# Altium schematic sheet 02_INTERFACE.SchDoc
size D; SheetNumber: 0; SheetTotal: 0
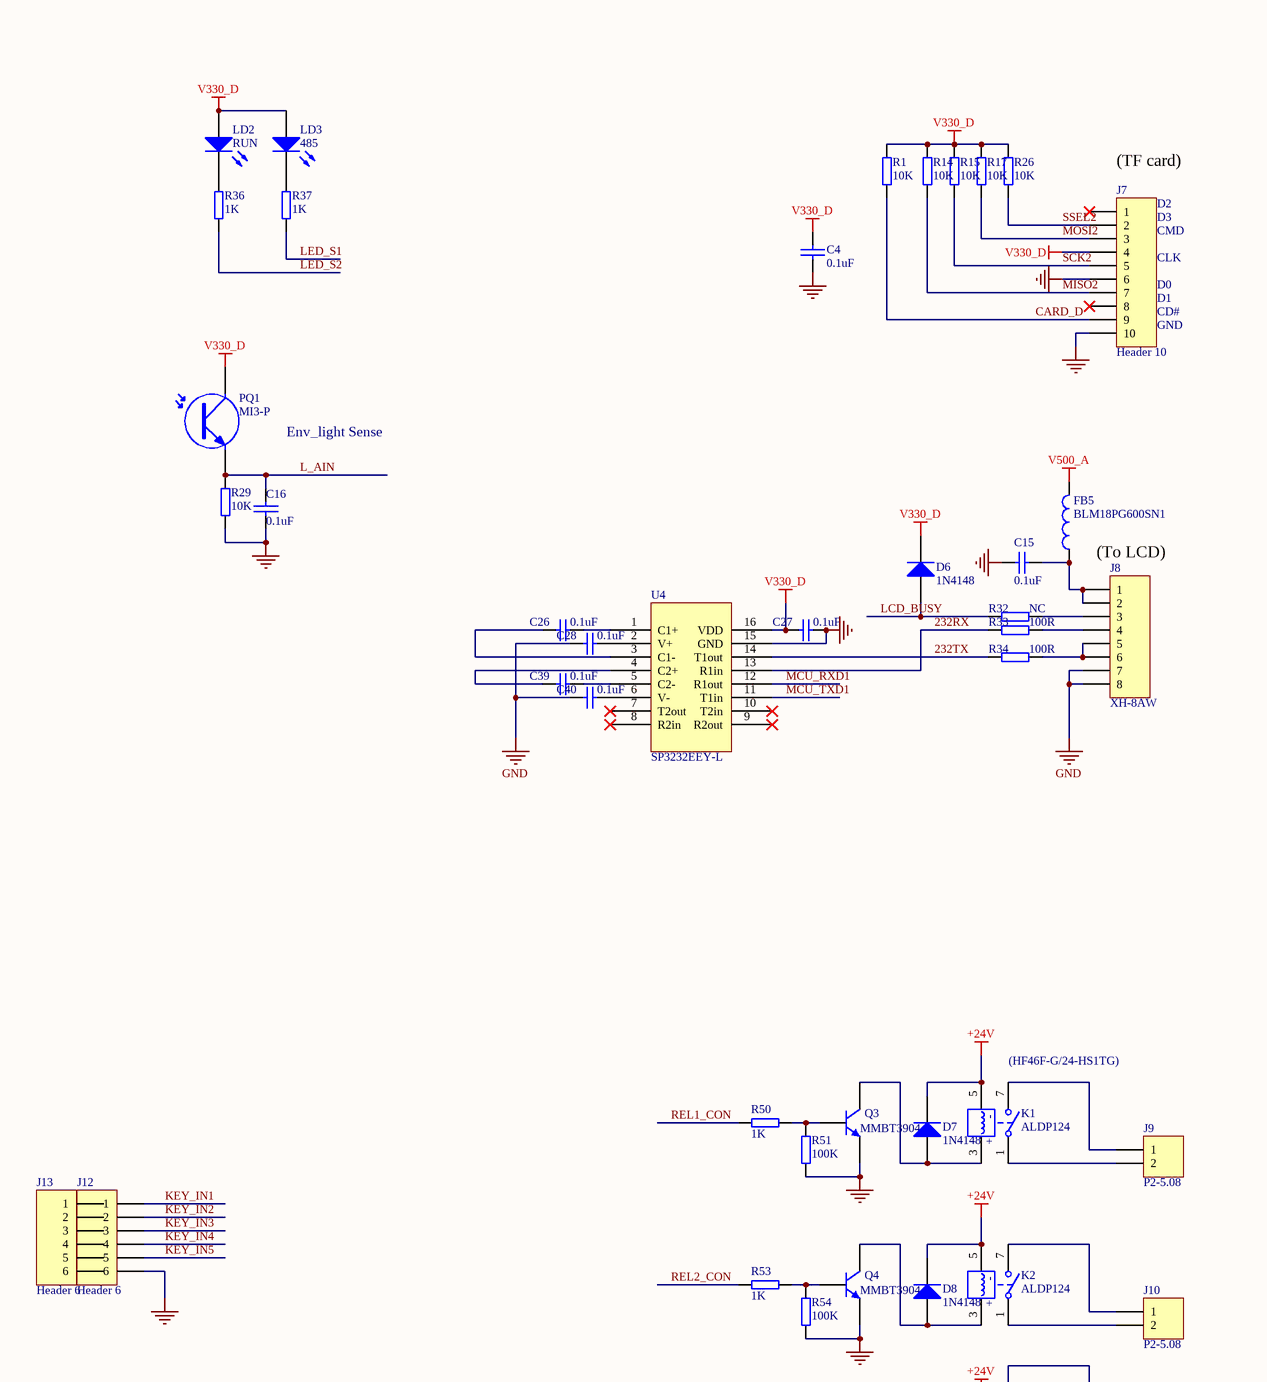
[diagram p0: 02_INTERFACE.SchDoc, top left]
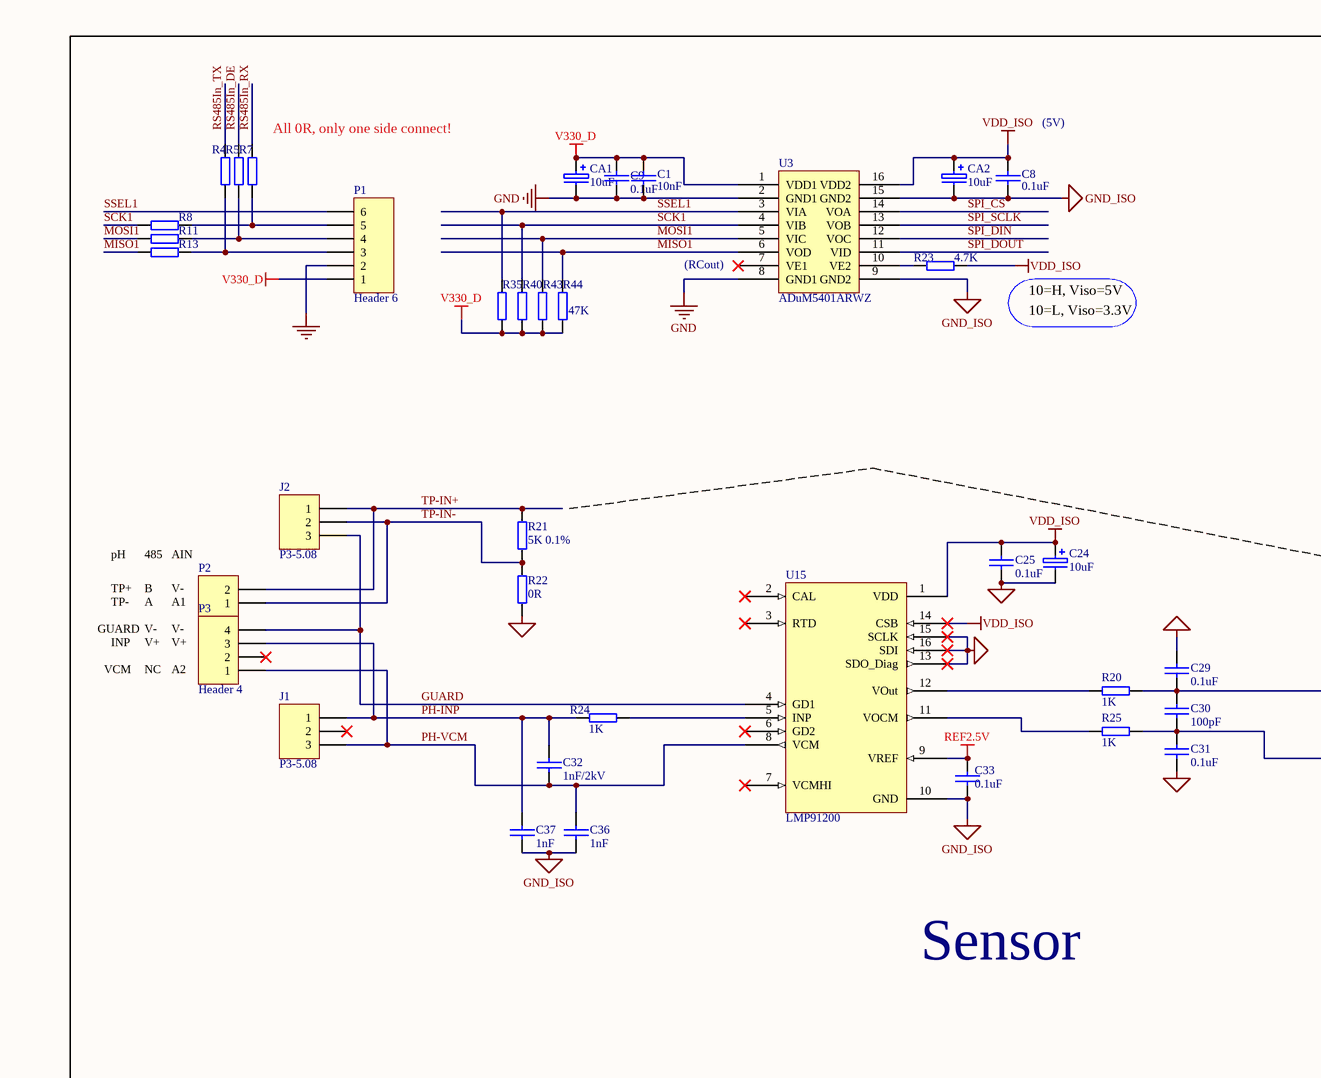
[diagram p1: 02_INTERFACE.SchDoc, top middle]
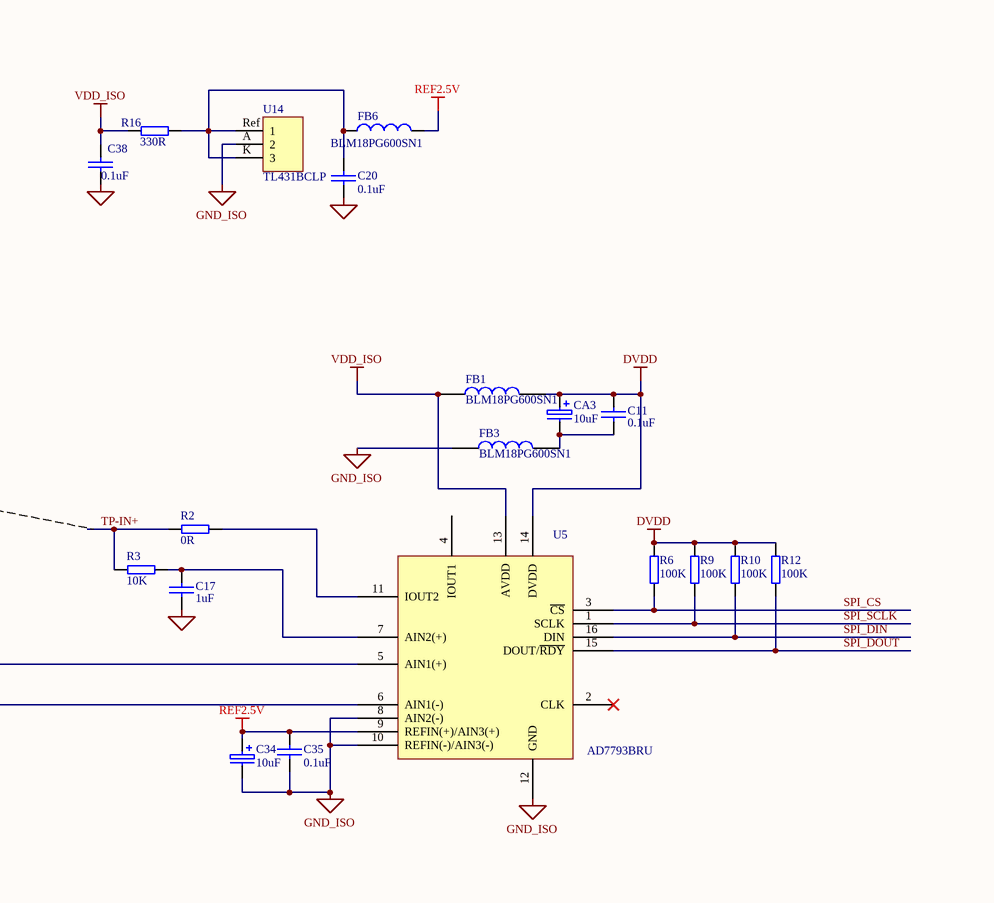
[diagram p2: 02_INTERFACE.SchDoc, top right]
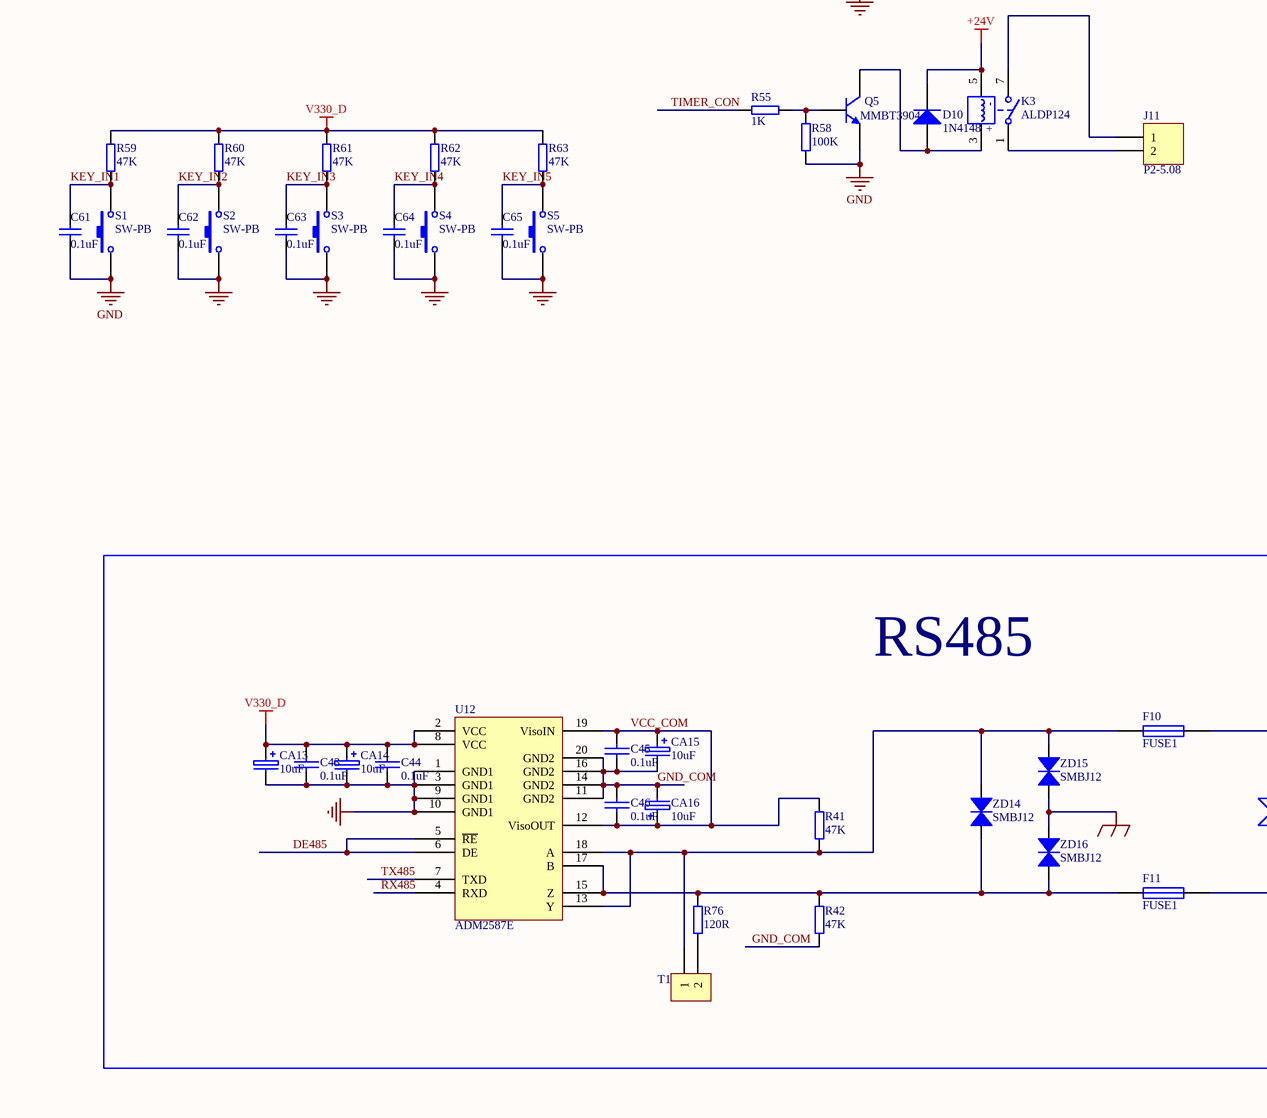
[diagram p3: 02_INTERFACE.SchDoc, bottom left]
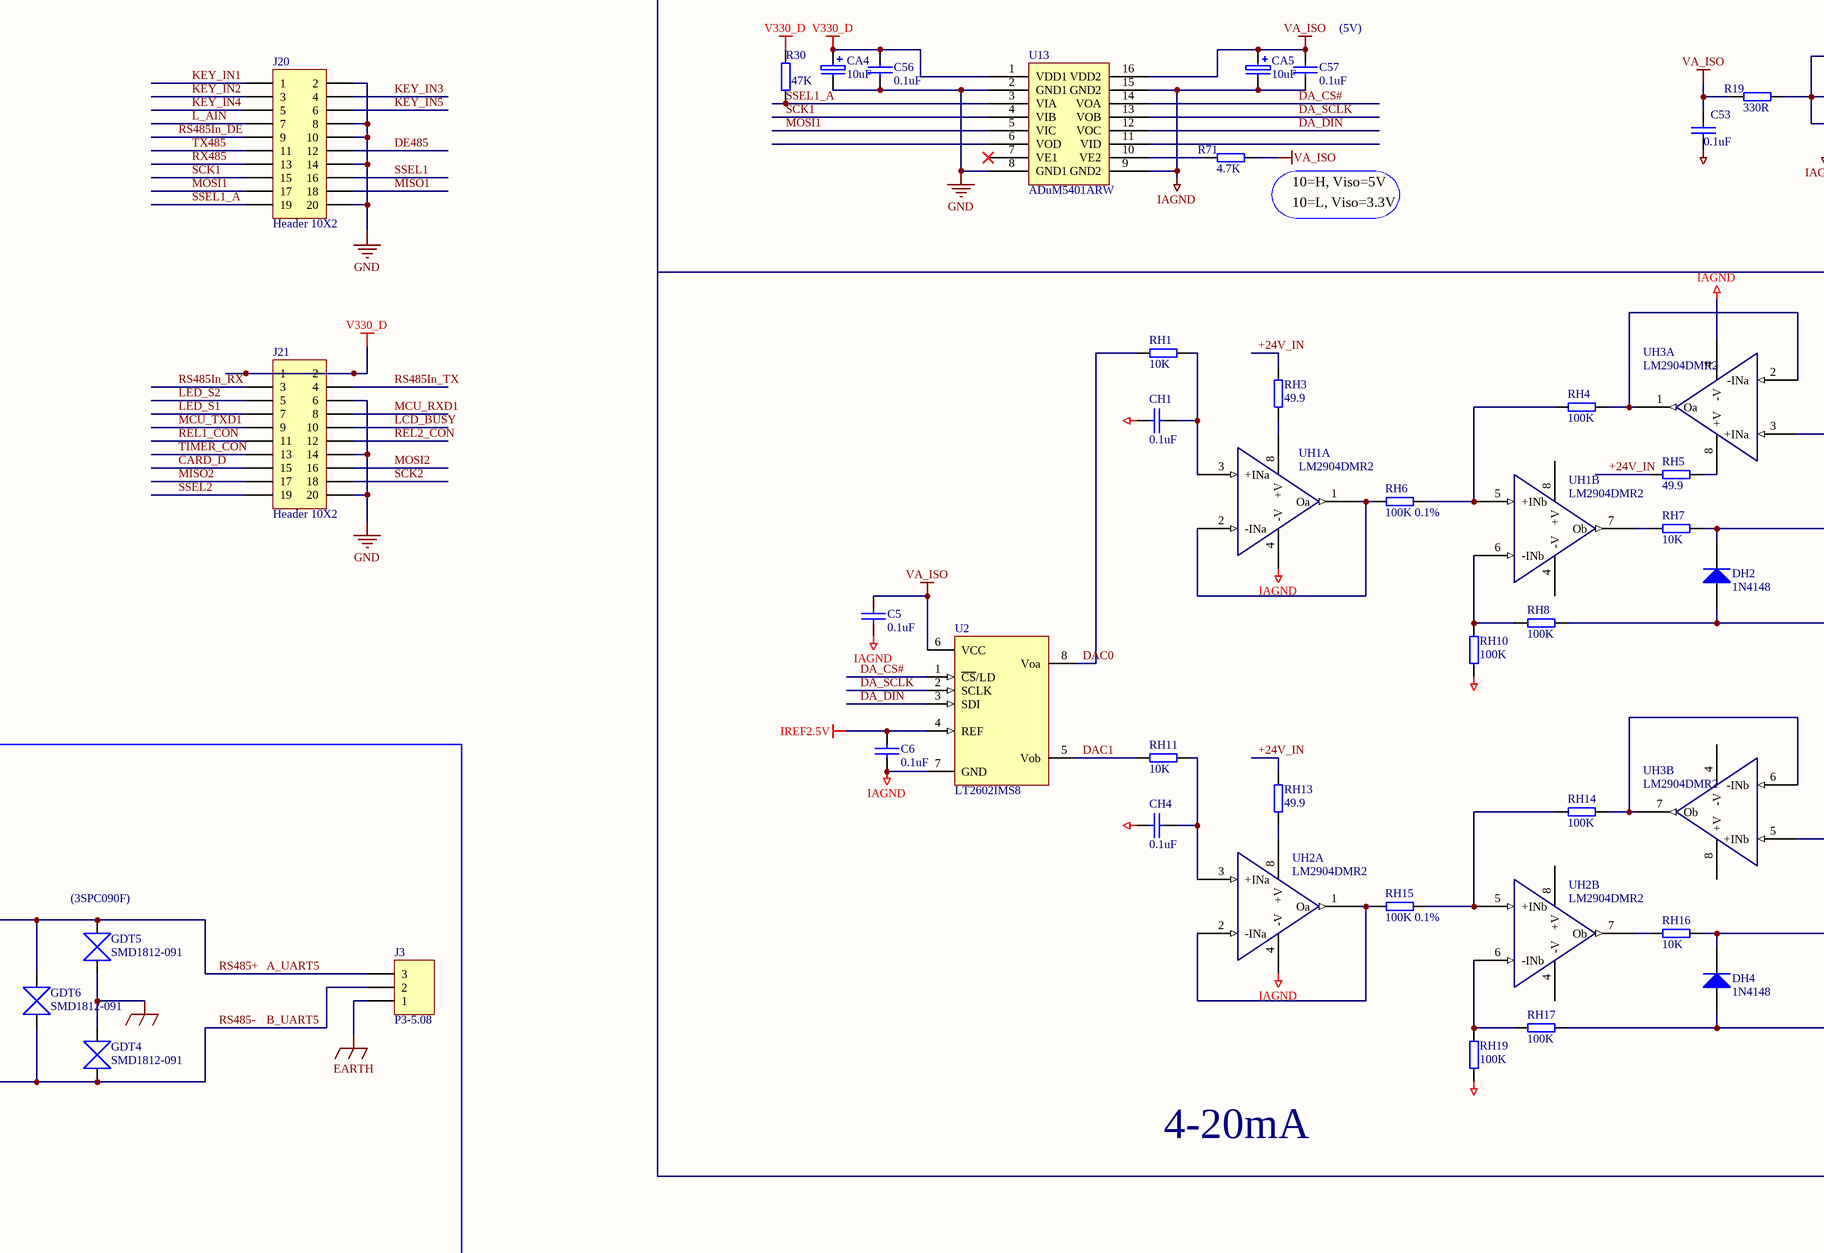
[diagram p4: 02_INTERFACE.SchDoc, bottom middle]
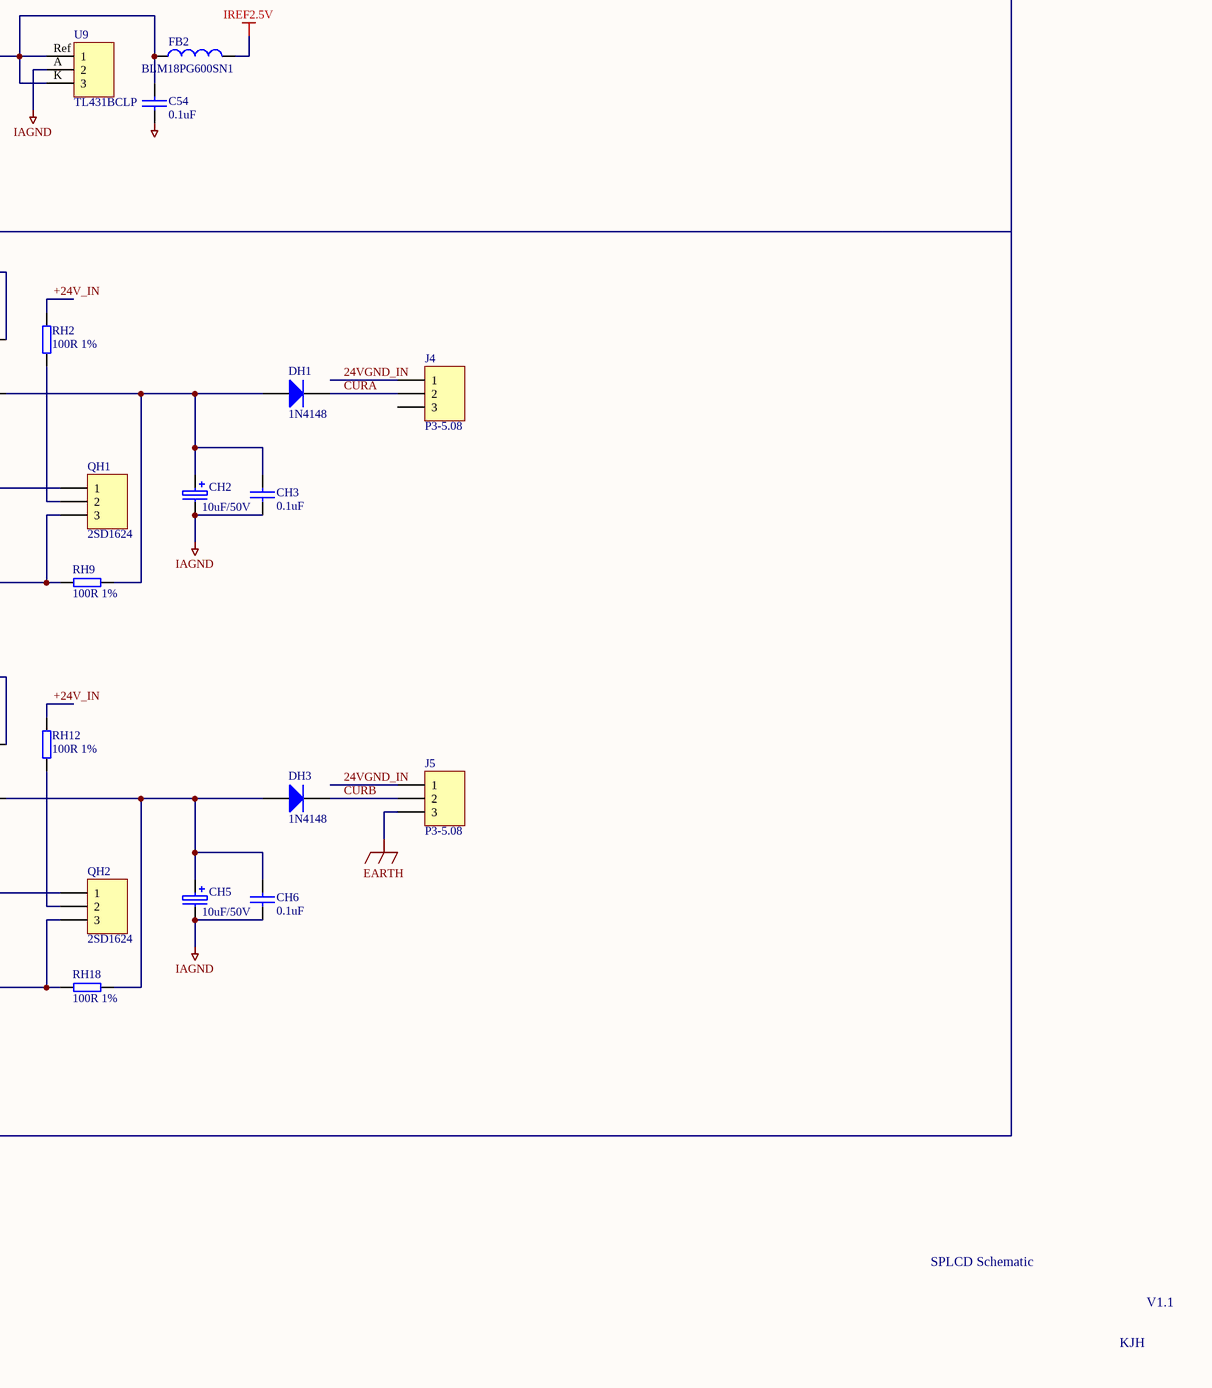
[diagram p5: 02_INTERFACE.SchDoc, bottom right]

## Parts
C1  10nF  [0603A]
C4  0.1uF  [0603A]
C5  0.1uF  [0603A]
C6  0.1uF  [0603A]
C8  0.1uF  [0603A]
C9  0.1uF  [0603A]
C11  0.1uF  [0603A]
C15  0.1uF  [0603A]
C16  0.1uF  [0603]
C17  1uF  [0603A]
C20  0.1uF  [0603A]
C24  10uF  [1206]
C25  0.1uF  [0603A]
C26  0.1uF  [0603A]
C27  0.1uF  [0603A]
C28  0.1uF  [0603A]
C29  0.1uF  [0603A]
C30  100pF  [0603A]
C31  0.1uF  [0603A]
C32  1nF/2kV  [RAD-0.2]
C33  0.1uF  [0603A]
C34  10uF  [1206]
C35  0.1uF  [0603A]
C36  1nF  [0603A]
C37  1nF  [0603A]
C38  0.1uF  [0603A]
C39  0.1uF  [0603A]
C40  0.1uF  [0603A]
C43  0.1uF  [0603]
C44  0.1uF  [0603]
C45  0.1uF  [0603]
C46  0.1uF  [0603]
C53  0.1uF  [0603A]
C54  0.1uF  [0603A]
C56  0.1uF  [0603A]
C57  0.1uF  [0603A]
C61  0.1uF  [0603A]
C62  0.1uF  [0603A]
C63  0.1uF  [0603A]
C64  0.1uF  [0603A]
C65  0.1uF  [0603A]
CA1  10uF  [1206]
CA2  10uF  [1206]
CA3  10uF  [1206]
CA4  10uF  [1206]
CA5  10uF  [1206C]
CA13  10uF  [1206C]
CA14  10uF  [1206C]
CA15  10uF  [1206C]
CA16  10uF  [1206C]
CH1  0.1uF  [0603A]
CH2  10uF/50V  [1206]
CH3  0.1uF  [0603A]
CH4  0.1uF  [0603A]
CH5  10uF/50V  [1206]
CH6  0.1uF  [0603A]
D6  1N4148  [1206]
D7  1N4148  [1206]
D8  1N4148  [1206]
D10  1N4148  [1206]
DH1  1N4148  [1206D]
DH2  1N4148  [1206D]
DH3  1N4148  [1206D]
DH4  1N4148  [1206D]
F10  FUSE1  [1206]
F11  FUSE1  [1206]
FB1  BLM18PG600SN1  [0603A]
FB2  BLM18PG600SN1  [0603A]
FB3  BLM18PG600SN1  [0603A]
FB5  BLM18PG600SN1  [0603A]
FB6  BLM18PG600SN1  [0603A]
GDT4  SMD1812-091  [1812]
GDT5  SMD1812-091  [1812]
GDT6  SMD1812-091  [1812]
J1  P3-5.08  [PH3-5.08mm]
J2  P3-5.08  [PH3-5.08mm]
J3  P3-5.08  [PH3-5.08mm]
J4  P3-5.08  [PH3-5.08mm]
J5  P3-5.08  [PH3-5.08mm]
J7  Header 10  [TF Socket]
J8  XH-8AW  [HDR1X8]
J9  P2-5.08  [PH2-5.08mm]
J10  P2-5.08  [PH2-5.08mm]
J11  P2-5.08  [PH2-5.08mm]
J12  Header 6  [HDR1X6]
J13  Header 6  [HDR1X6]
J20  Header 10X2  [HDR2X10]
J21  Header 10X2  [HDR2X10]
K1  ALDP124  [ALDP124]
K2  ALDP124  [ALDP124]
K3  ALDP124  [ALDP124]
LD2  RUN  [LED]
LD3  485  [LED]
P1  Header 6  [HDR1X6]
P2  Header 2  [HDR1X2]  (value not drawn)
P3  Header 4  [HDR1X4]
PQ1  MI3-P  [LED]
Q3  MMBT3904  [SOT23_N]
Q4  MMBT3904  [SOT23_N]
Q5  MMBT3904  [SOT23_N]
QH1  2SD1624  [SOT89M]
QH2  2SD1624  [SOT89M]
R1  10K  [0603A]
R2  0R  [0603A]
R3  10K  [0603A]
R4  0R  [0603A]  (value not drawn)
R5  0R  [0603A]  (value not drawn)
R6  100K  [0603A]
R7  0R  [0603A]  (value not drawn)
R8  0R  [0603A]  (value not drawn)
R9  100K  [0603A]
R10  100K  [0603A]
R11  0R  [0603A]  (value not drawn)
R12  100K  [0603A]
R13  0R  [0603A]  (value not drawn)
R14  10K  [0603A]
R15  10K  [0603A]
R16  330R  [0603A]
R17  10K  [0603A]
R19  330R  [0603A]
R20  1K  [0603A]
R21  5K 0.1%  [0603A]
R22  0R  [0603A]
R23  4.7K  [0603A]
R24  1K  [0603A]
R25  1K  [0603A]
R26  10K  [0603A]
R29  10K  [0603A]
R30  47K  [0603A]
R32  NC  [0603A]
R33  100R  [0603A]
R34  100R  [0603A]
R35  47K  [0603A]  (value not drawn)
R36  1K  [0603A]
R37  1K  [0603A]
R40  47K  [0603A]  (value not drawn)
R41  47K  [0603]
R42  47K  [0603]
R43  47K  [0603A]  (value not drawn)
R44  47K  [0603A]
R50  1K  [0603A]
R51  100K  [0603A]
R53  1K  [0603A]
R54  100K  [0603A]
R55  1K  [0603A]
R58  100K  [0603A]
R59  47K  [0603A]
R60  47K  [0603A]
R61  47K  [0603A]
R62  47K  [0603A]
R63  47K  [0603A]
R71  4.7K  [0603A]
R76  120R  [0603]
RH1  10K  [0603A]
RH2  100R 1%  [0603A]
RH3  49.9  [0603A]
RH4  100K  [0603A]
RH5  49.9  [0603A]
RH6  100K 0.1%  [0603A]
RH7  10K  [0603A]
RH8  100K  [0603A]
RH9  100R 1%  [0603A]
RH10  100K  [0603A]
RH11  10K  [0603A]
RH12  100R 1%  [0603A]
RH13  49.9  [0603A]
RH14  100K  [0603A]
RH15  100K 0.1%  [0603A]
RH16  10K  [0603A]
RH17  100K  [0603A]
RH18  100R 1%  [0603A]
RH19  100K  [0603A]
S1  SW-PB
S2  SW-PB
S3  SW-PB
S4  SW-PB
S5  SW-PB
T1  (no value)  [SIP2]
U2  LT2602IMS8  [LT2602]
U3  ADuM5401ARWZ  [ADUM1401]
U4  SP3232EEY-L  [TSSOP-16]
U5  AD7793BRU  [AD7793]
U9  TL431BCLP  [HDR1X3]
U12  ADM2587E  [SOL-20]
U13  ADuM5401ARW  [ADUM1401]
U14  TL431BCLP  [HDR1X3]
U15  LMP91200  [LMP91200]
UH1  LM2904DMR2  [SO8_M]  (parts A,B of 2)
UH2  LM2904DMR2  [SO8_M]  (parts A,B of 2)
UH3  LM2904DMR2  [SO8_M]  (parts A,B of 2)
ZD14  SMBJ12  [ZD]
ZD15  SMBJ12  [ZD]
ZD16  SMBJ12  [ZD]

## Blocks framed on the sheet
Sensor: C1 C8 C9 C11 C17 C20 C24 C25 C29-C38 CA1-CA3 FB1 FB3 FB6 J1 J2 P1-P3 R2-R13 R16 R20-R25 R35 R40 R43 R44 U3 U5 U14 U15
RS485: C43-C46 CA13-CA16 F10 F11 GDT4-GDT6 J3 R41 R42 R76 T1 U12 ZD14-ZD16

## Nets
+24V: D7.2(K) D8.2(K) D10.2(K) K1.5 K2.5 K3.5
DVDD: C11.1 CA3.1 FB1.2 R6.1 R9.1 R10.1 R12.1 U5.14(DVDD)
EARTH: GDT4.2 GDT5.1 J3.1 J5.3 ZD15.2 ZD16.1
GND: C1.2 C4.1 C9.1 C15.2 C16.2 C27.1 C28.2 C40.2 C43.2 C44.2 C56.2 C61.2 C62.2 C63.2 C64.2 C65.2 CA1.2 CA4.2 CA13.2 CA14.2 J7.6 J7.10 J8.7 J8.8 J12.6 J20.2 J20.8 J20.10 J20.14 J20.20 J21.6 J21.14 J21.20 P1.2 Q3.2(E) Q4.2(E) Q5.2(E) R29.1 R51.2 R54.2 R58.2 S1.1 S2.1 S3.1 S4.1 S5.1 U3.2(GND1) U3.8(GND1) U4.15(GND) U12.1(GND1) U12.3(GND1) U12.9(GND1) U12.10(GND1) U13.2(GND1) U13.8(GND1)
GND_ISO: C8.2 C17.2 C20.2 C24.2 C25.2 C29.1 C31.2 C33.2 C34.2 C35.2 C36.2 C37.2 C38.2 CA2.2 FB3.1 R22.2 U3.9(GND2) U3.15(GND2) U5.8(AIN2(-)) U5.10(REFIN(-)/AIN3(-)) U5.12(GND) U14.2 U15.10(GND) U15.13(SDO_Diag) U15.15(SCLK) U15.16(SDI)
IAGND: C5.2 C6.2 C53.2 C54.2 C57.2 CA5.2 CH1.1 CH2.2 CH3.1 CH4.1 CH5.2 CH6.1 RH10.2 RH19.2 U2.7(GND) U9.2 U13.9(GND2) U13.15(GND2) UH1.4(-V) UH2.4(-V) UH3.4(-V)
IREF2.5V: C6.1 FB2.2 U2.4(REF)
REF2.5V: C33.1 C34.1 C35.1 FB6.2 U5.9(REFIN(+)/AIN3(+)) U15.9(VREF)
V330_D: C1.1 C4.2 C9.2 C27.2 C43.1 C44.1 C56.1 CA1.1 CA4.1 CA13.1 CA14.1 D6.2(K) J7.4 J21.1 J21.2 LD2.1(A) LD3.1(A) P1.1 PQ1.1(C) R1.2 R14.2 R15.2 R17.2 R26.2 R30.2 R35.1 R40.1 R43.1 R44.1 R59.2 R60.2 R61.2 R62.2 R63.2 U3.1(VDD1) U4.16(VDD) U12.2(VCC) U12.8(VCC) U13.1(VDD1)
V500_A: FB5.2
VA_ISO: C5.1 C53.1 C57.1 CA5.1 R19.2 R71.1 U2.6(VCC) U13.16(VDD2)
VDD_ISO: C8.1 C24.1 C25.1 C38.1 CA2.1 FB1.1 R16.2 R23.2 U3.16(VDD2) U5.13(AVDD) U15.1(VDD) U15.14(CSB)
24VGND_IN: J4.1 J5.1
232RX: R33.2 U4.13(R1in)
232TX: R34.2 U4.14(T1out)
+24V_IN: RH2.1 RH3.1 RH5.1 RH12.1 RH13.1
A_UART5: F10.2 GDT5.2 GDT6.2 J3.3  [also labelled RS485+]
B_UART5: F11.2 GDT4.1 GDT6.1 J3.2  [also labelled RS485-]
CARD_D: J7.9 J21.15 R1.1
CURA: DH1.2(K) J4.2
CURB: DH3.2(K) J5.2
DA_CS#: U2.1(~{CS}/LD) U13.14(VOA)
DA_DIN: U2.3(SDI) U13.12(VOC)
DA_SCLK: U2.2(SCLK) U13.13(VOB)
DAC0: RH1.2 U2.8(Voa)
DAC1: RH11.2 U2.5(Vob)
DE485: J20.12 U12.5(~{RE}) U12.6(DE)
GND_COM: C45.2 C46.1 CA15.2 CA16.2 R42.2 U12.11(GND2) U12.14(GND2) U12.16(GND2) U12.20(GND2)
GUARD: J2.3 P3.4 U15.4(GD1)
KEY_IN1: C61.1 J12.1 J20.1 R59.1 S1.2
KEY_IN2: C62.1 J12.2 J20.3 R60.1 S2.2
KEY_IN3: C63.1 J12.3 J20.4 R61.1 S3.2
KEY_IN4: C64.1 J12.4 J20.5 R62.1 S4.2
KEY_IN5: C65.1 J12.5 J20.6 R63.1 S5.2
L_AIN: C16.1 J20.7 PQ1.3(E) R29.2
LCD_BUSY: D6.1(A) J21.10 R32.2
LED_S1: J21.7 R37.1
LED_S2: J21.5 R36.1
MCU_RXD1: J21.8 U4.12(R1out)
MCU_TXD1: J21.9 U4.11(T1in)
MISO1: J20.18 R13.2 R44.2 U3.6(VOD)
MISO2: J7.7 J21.17 R14.1
MOSI1: J20.17 R11.2 R43.2 U3.5(VIC) U13.5(VIC)
MOSI2: J7.3 J21.16 R17.1
PH-INP: C32.1 C37.1 J1.1 P3.3 R24.1
PH-VCM: C32.2 C36.1 J1.3 P3.1 U15.8(VCM)
REL1_CON: J21.11 R50.2
REL2_CON: J21.12 R53.2
RS485In_DE: J20.9 R5.1
RS485In_RX: J21.3 R7.1
RS485In_TX: J21.4 R4.1
RX485: J20.13 U12.4(RXD)
SCK1: J20.15 R8.2 R40.2 U3.4(VIB) U13.4(VIB)
SCK2: J7.5 J21.18 R15.1
SPI_CS: R6.2 U3.14(VOA) U5.3(~{CS})
SPI_DIN: R10.2 U3.12(VOC) U5.16(DIN)
SPI_DOUT: R12.2 U3.11(VID) U5.15(DOUT/~{RDY})
SPI_SCLK: R9.2 U3.13(VOB) U5.1(SCLK)
SSEL1: J20.16 P1.6 R35.2 U3.3(VIA)
SSEL1_A: J20.19 R30.1 U13.3(VIA)
SSEL2: J7.2 J21.19 R26.1
TIMER_CON: J21.13 R55.2
TP-IN+: J2.1 P2.2 R2.1 R3.1 R21.2
TP-IN-: J2.2 P2.1 R21.1 R22.1
TX485: J20.11 U12.7(TXD)
VCC_COM: C45.1 C46.2 CA15.1 CA16.1 R41.1 U12.12(VisoOUT) U12.19(VisoIN)
NetC11_2: C11.2 CA3.2 FB3.2
NetC15_1: C15.1 FB5.1 J8.1 J8.2
NetC17_1: C17.1 R3.2 U5.7(AIN2(+))
NetC20_1: C20.1 FB6.1 R16.1 U14.1 U14.3
NetC26_1: C26.1 U4.1(C1+)
NetC26_2: C26.2 U4.3(C1-)
NetC28_1: C28.1 U4.2(V+)
NetC29_2: C29.2 C30.1 R20.2 U5.5(AIN1(+))
NetC30_2: C30.2 C31.1 R25.2 U5.6(AIN1(-))
NetC39_1: C39.1 U4.5(C2-)
NetC39_2: C39.2 U4.4(C2+)
NetC40_1: C40.1 U4.6(V-)
NetC54_1: C54.1 FB2.1 R19.1 U9.1 U9.3
NetCH1_2: CH1.2 RH1.1 UH1.3(+INa)
NetCH2_1: CH2.1 CH3.2 DH1.1(A) RH9.2 UH3.3(+INa)
NetCH4_2: CH4.2 RH11.1 UH2.3(+INa)
NetCH5_1: CH5.1 CH6.2 DH3.1(A) RH18.2 UH3.5(+INb)
NetD7_1: D7.1(A) K1.3 Q3.3(C)
NetD8_1: D8.1(A) K2.3 Q4.3(C)
NetD10_1: D10.1(A) K3.3 Q5.3(C)
NetDH2_1: DH2.1(A) QH1.3 RH8.2 RH9.1
NetDH2_2: DH2.2(K) QH1.1 RH7.2
NetDH4_1: DH4.1(A) QH2.3 RH17.2 RH18.1
NetDH4_2: DH4.2(K) QH2.1 RH16.2
NetF10_1: F10.1 R41.2 T1.1 U12.13(Y) U12.18(A) ZD14.1 ZD15.1
NetF11_1: F11.1 R42.1 R76.1 U12.15(Z) U12.17(B) ZD14.2 ZD16.2
NetJ8_3: J8.3 R32.1
NetJ8_4: J8.4 R33.1
NetJ8_5: J8.5 J8.6 R34.1
NetJ9_1: J9.1 K1.7
NetJ9_2: J9.2 K1.1
NetJ10_1: J10.1 K2.7
NetJ10_2: J10.2 K2.1
NetJ11_1: J11.1 K3.7
NetJ11_2: J11.2 K3.1
NetLD2_2: LD2.2(K) R36.2
NetLD3_2: LD3.2(K) R37.2
NetP1_3: P1.3 R4.2 R13.1
NetP1_4: P1.4 R5.2 R11.1
NetP1_5: P1.5 R7.2 R8.1
NetQ3_1: Q3.1(B) R50.1 R51.1
NetQ4_1: Q4.1(B) R53.1 R54.1
NetQ5_1: Q5.1(B) R55.1 R58.1
NetQH1_2: QH1.2 RH2.2
NetQH2_2: QH2.2 RH12.2
NetR2_2: R2.2 U5.11(IOUT2)
NetR20_1: R20.1 U15.12(VOut)
NetR23_1: R23.1 U3.10(VE2)
NetR24_2: R24.2 U15.5(INP)
NetR25_1: R25.1 U15.11(VOCM)
NetR71_2: R71.2 U13.10(VE2)
NetR76_2: R76.2 T1.2
NetRH3_2: RH3.2 UH1.8(+V)
NetRH4_1: RH4.1 RH6.1 UH1.5(+INb)
NetRH4_2: RH4.2 UH3.1(Oa) UH3.2(-INa)
NetRH5_2: RH5.2 UH3.8(+V)
NetRH6_2: RH6.2 UH1.1(Oa) UH1.2(-INa)
NetRH7_1: RH7.1 UH1.7(Ob)
NetRH8_1: RH8.1 RH10.1 UH1.6(-INb)
NetRH13_2: RH13.2 UH2.8(+V)
NetRH14_1: RH14.1 RH15.1 UH2.5(+INb)
NetRH14_2: RH14.2 UH3.6(-INb) UH3.7(Ob)
NetRH15_2: RH15.2 UH2.1(Oa) UH2.2(-INa)
NetRH16_1: RH16.1 UH2.7(Ob)
NetRH17_1: RH17.1 RH19.1 UH2.6(-INb)

Not connected (* = marked no-connect by the designer): J1 2*; J4 3; J7 1* 8*; J13 1 2 3 4 5 6; P3 2*; U3 7(VE1)*; U4 7(T2out)* 8(R2in)* 9(R2out)* 10(T2in)*; U5 2(CLK)* 4(IOUT1); U13 6(VOD) 7(VE1)* 11(VID); U15 2(CAL)* 3(RTD)* 6(GD2)* 7(VCMHI)*

## Notes on the sheet
- All 0R, only one side connect!
- (near C8) (5V)
- (near J7) (TF card)
- (near U14) Ref
- (near U14) A
- (near U14) K
- (near J7) D2
- (near J7) D3
- (near J7) CMD
- (near U3) (RCout)
- (near J7) CLK
- (near J7) D0
- (near J7) D1
- (near J7) CD#
- (near J7) GND
- 10=H, Viso=5V
- 10=L, Viso=3.3V
- Env_light Sense
- pH
- 485
- AIN
- (To LCD)
- GUARD
- TP+
- TP-
- B
- A
- V-
- A1
- VCM
- INP
- NC
- V+
- A2
- (near K1) (HF46F-G/24-HS1TG)
- (near C57) (5V)
- (near U9) Ref
- (near U9) A
- (near U9) K
- (near R71) 10=H, Viso=5V
- (near GDT5) (3SPC090F)
- 4-20mA
- SPLCD Schematic
- KJH
- V1.1
- (in symbol S1A120000) -; +

## Library data of the parts
C1 C8 C9 C11 C17 C43-C46 = CAP: 电容
C4-C6 C16 C20 C25 C29-C33 C35-C38 C53 C54 C56 C57 CH1 CH3 CH4 CH6 = CAP: Capacitor
C15 C61-C65 = Cap: Capacitor, X7R Ceramic
C24 C34 CA1-CA5 = C: 极性电容
C26-C28 C39 C40 = Cap: 'Capacitor, X7R Ceramic
CA13-CA16 CH2 CH5 = CAPE: 极性电容
D6-D8 D10 = Diode 1N4148: High Conductance Fast Diode; Published: 8-Jun-2000; LatestRevisionDate: 17-Jul-2002; LatestRevisionNote: Re-released for DXP Platform.; DatasheetVersion: 1997; PackageReference: DO-35; Publisher: Altium Limited; PackageDescription: Diode, Axial; Body 3.8 x 1.9 mm (LxDia. max), Lead Dia. 0.53 mm (max); Code_JEDEC: DO-204-AH; ComponentLink1Description: Manufacturer Link; ComponentLink1URL: http://www.fairchildsemi.com/; ComponentLink2Description: Datasheet; ComponentLink2URL: http://www.fairchildsemi.com/ds/1N%2F1N4148.pdf
DH1-DH4 = Diode 1N4001: 1 Amp General Purpose Rectifier; Published: 8-Jun-2000; LatestRevisionDate: 17-Jul-2002; LatestRevisionNote: Re-released for DXP Platform.; DatasheetVersion: 1998; PackageVersion: Aug-1999; PackageReference: DO-41; Publisher: Altium Limited; PackageDescription: Diode, Axial; Body 5.2 x 2.7 mm (LxDia. max), Lead Dia. 0.86 mm (max); Code_JEDEC: DO-204-AL; ComponentLink1Description: Manufacturer Link; ComponentLink1URL: http://www.fairchildsemi.com/; ComponentLink2Description: Datasheet; ComponentLink2URL: http://www.fairchildsemi.com/ds/1N%2F1N4001.pdf
F10 F11 = FUSE1: Fuse
FB1 FB3 = INDUCTOR
FB2 FB5 FB6 = Inductor: Code_IEC: 1005; Value: 10mH; Published: 8-Jun-2000; LatestRevisionDate: 29-May-2009; LatestRevisionNote: IPC-7351 Footprint Added.; PackageReference: 0402-A; Publisher: Altium Limited; PackageDescription: Chip Inductor; Code_JEITA: 0402
GDT4-GDT6 = BT90
J1-J5 QH1 QH2 = Header 3: Header, 3-Pin; LatestRevisionDate: 17-Jul-2002; LatestRevisionNote: Re-released for DXP Platform.; Publisher: Altium Limited
J7 = Header 10: Header, 10-Pin; LatestRevisionDate: 17-Jul-2002; LatestRevisionNote: Re-released for DXP Platform.; Publisher: Altium Limited
J8 = Header 8: Header, 8-Pin; LatestRevisionDate: 17-Jul-2002; LatestRevisionNote: Re-released for DXP Platform.; Publisher: Altium Limited
J9-J11 P2 = Header 2: Header, 2-Pin; LatestRevisionDate: 17-Jul-2002; LatestRevisionNote: Re-released for DXP Platform.; Publisher: Altium Limited
J12 J13 P1 = Header 6: Header, 6-Pin; LatestRevisionDate: 17-Jul-2002; LatestRevisionNote: Re-released for DXP Platform.; Publisher: Altium Limited
J20 J21 = Header 10X2: Header, 10-Pin, Dual row; LatestRevisionDate: 17-Jul-2002; LatestRevisionNote: Re-released for DXP Platform.; Publisher: Altium Limited
K1-K3 = S1A120000: 24V coil, 5A SPST Relay; PACKAGE: DIP
LD2 LD3 = LED0: Typical INFRARED GaAs LED; Published: 8-Jun-2000; LatestRevisionDate: 08-Jul-2005; LatestRevisionNote: Mech Layer 1 removed.; PackageReference: LED-0; Publisher: Altium Limited; PackageDescription: LED; 2 Leads
P3 = Header 4: Header, 4-Pin; LatestRevisionDate: 17-Jul-2002; LatestRevisionNote: Re-released for DXP Platform.; Publisher: Altium Limited
PQ1 = Photo NPN: NPN Phototransistor; Published: 24-Mar-1999; LatestRevisionDate: 17-Jul-2002; LatestRevisionNote: Re-released for DXP Platform.; PackageReference: TO-220_A; Publisher: Altium Limited; Code_JEDEC: TO-220-AC
Q3-Q5 = MMBT3904: NPN Switching Transistor; Published: 17-Sep-2003; LatestRevisionDate: 12-Dec-2006; LatestRevisionNote: IPC-7351 Footprint Added.; DatasheetVersion: 13-May-2002; PackageVersion: May-1999; PackageReference: SOT23; Publisher: Altium Limited; PackageDescription: 3-Pin SOT-23 Package 0.95 mm Pitch, 2.3 mm Lead Span; ComponentLink1Description: Manufacturer Link; ComponentLink1URL: http://www.semiconductors.philips.com/; ComponentLink2Description: Datasheet; ComponentLink2URL: http://www.semiconductors.philips.com/acrobat/datasheets/MMBT3904_4.pdf
R1 R4 R5 R7 R8 R11 R13-R15 R17 R26 R29 R30 R32-R37 R40 R43 R44 R50 R51 R53-R55 R58-R63 = RE: 电阻
R2 R3 R6 R9 R10 R12 R20-R25 R41 R42 R76 = RES: 电阻
R16 R19 R71 RH1-RH6 RH8-RH15 RH17-RH19 = R: 电阻
RH7 RH16 = R: Resistor
S1-S5 = SW-PB: Switch; Published: 24-Mar-1999; LatestRevisionDate: 17-Jul-2002; LatestRevisionNote: Re-released for DXP Platform.; PackageReference: SPST-2; Publisher: Altium Limited; PackageDescription: Switch; 2 Leads
T1 = CON2: Connector
U2 = LT2602
U3 U13 = ADUM1401: 1Mbps Data Rate, 100ns Propagation delay
U4 = SP3232E: EXAR
U5 = AD7793
U9 U14 = Header 3: Programmable Precision Reference; LatestRevisionDate: 17-Jul-2002; LatestRevisionNote: Re-released for DXP Platform.; Publisher: Altium Limited
UH1-UH3 = AD8646
ZD14-ZD16 = SMBJ: 瞬变抑制二极管